# EAGLE design Control (EAGLE 9.6.2)
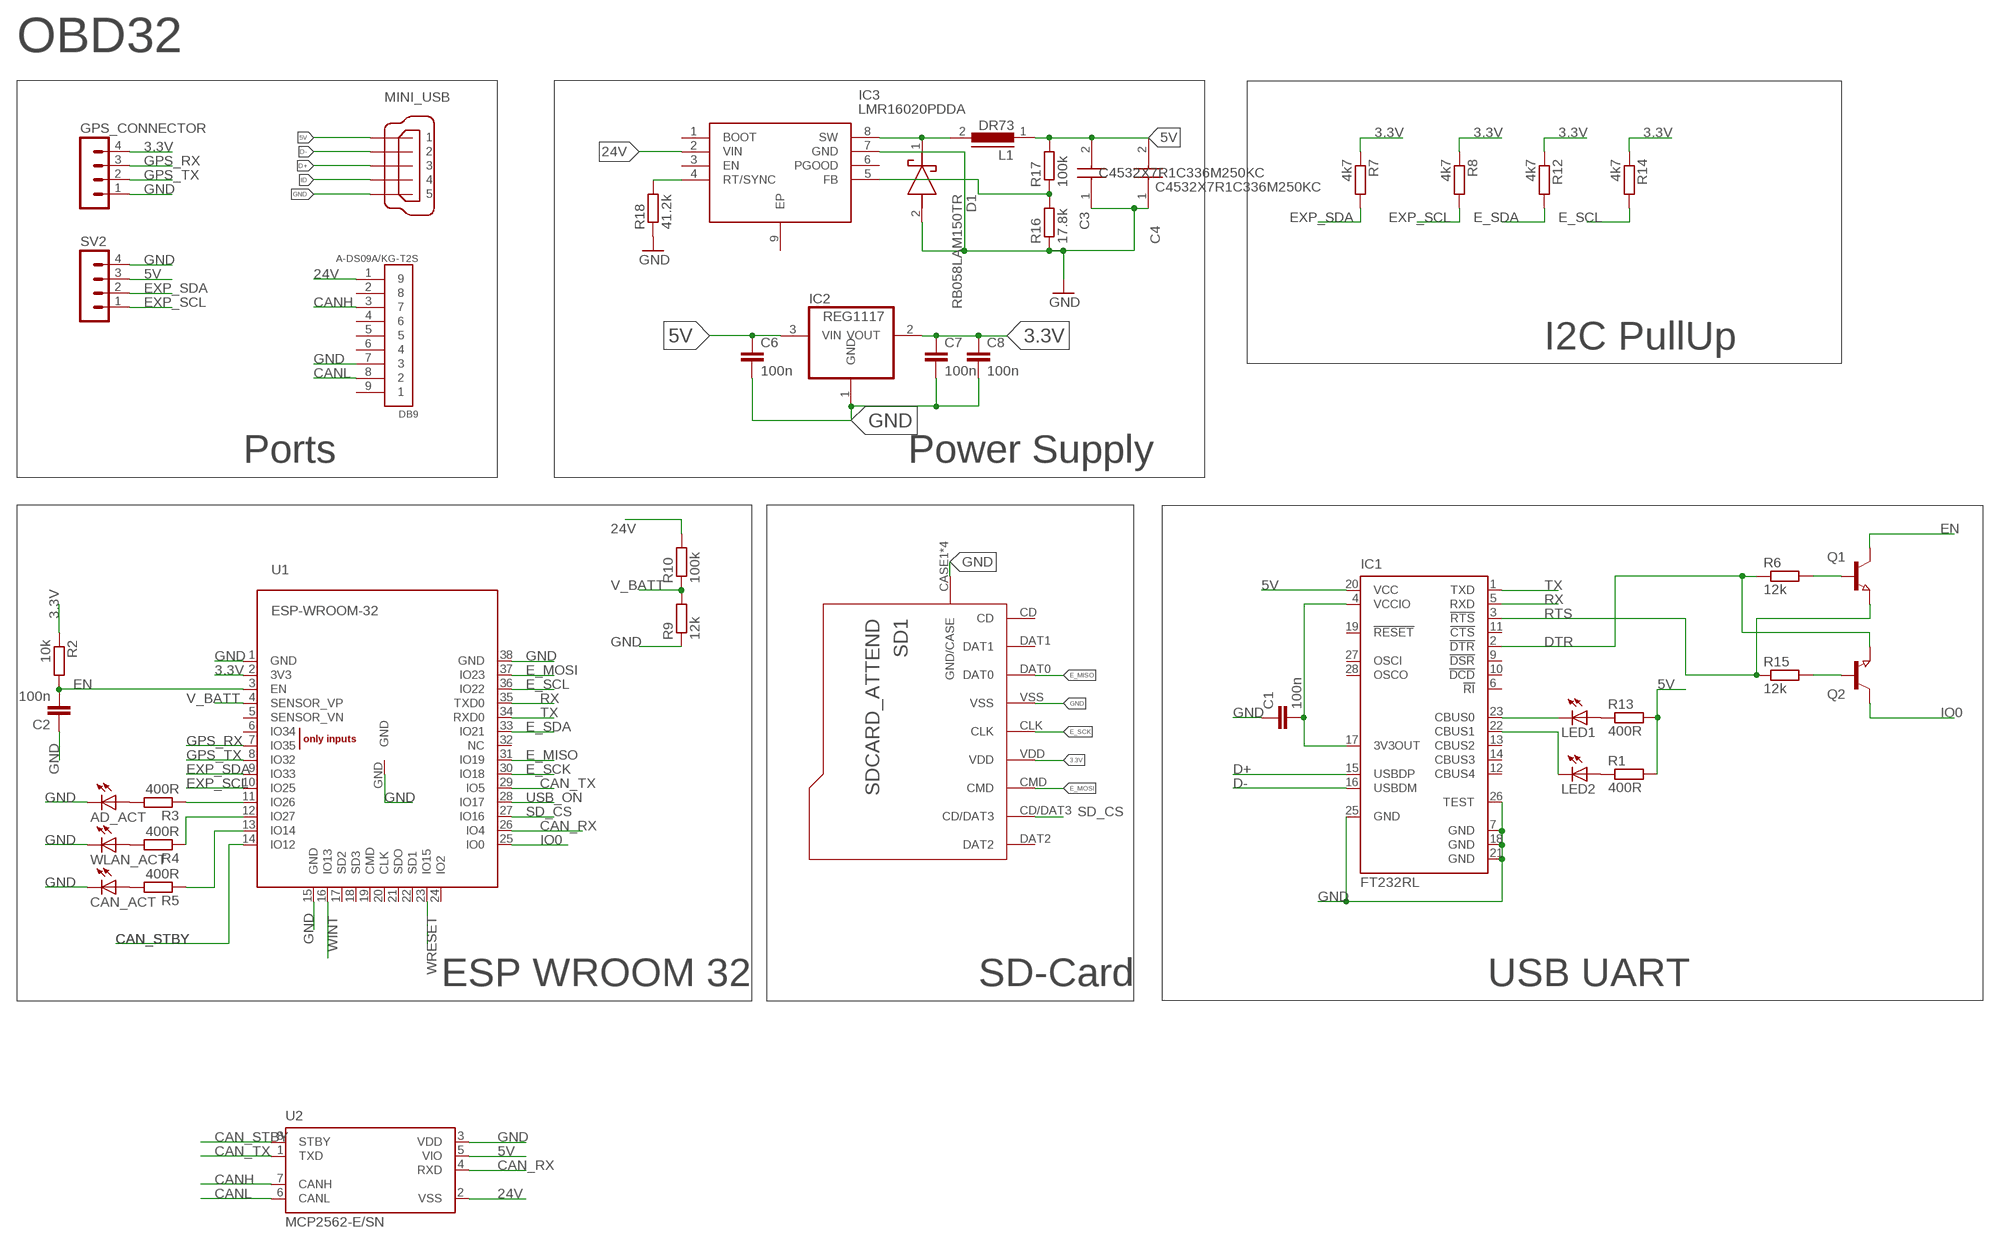
[diagram p0: schematic, sheet 1]

## Parts
AD_ACT  LEDCHIP-LED0805  [CHIP-LED0805]
C1  100n  C-EUC0805  [C0805]
C2  100n  C-EUC0805  [C0805]
C3  C4532X7R1C336M250KC  [CAPC4532X360N]
C4  C4532X7R1C336M250KC  [CAPC4532X360N]
C6  100n  C-EUC0805  [C0805]
C7  100n  C-EUC0805  [C0805]
C8  100n  C-EUC0805  [C0805]
CAN_ACT  LEDCHIP-LED0805  [CHIP-LED0805]
D1  RB058LAM150TR  [SODFL4725X105N]
DB9  A-DS09A/KG-T2S  [A-DS09A/KG-T2S]
GPS_CONNECTOR  MA04-1  [MA04-1]
IC1  FT232RL  [SSOP28]
IC2  REG1117  [SOT223]
IC3  LMR16020PDDA  [SOIC127P600X170-9N]
L1  DR73  [DR73]
LED1  LEDCHIPLED_0805  [CHIPLED_0805]
LED2  LEDCHIPLED_0805  [CHIPLED_0805]
MINI_USB  MINI-USB-32005-301  [32005-301]
Q1  NPN-TRANSISTOR_SOT23  [SOT23]
Q2  NPN-TRANSISTOR_SOT23  [SOT23]
R1  400R  R-EU_R0805  [R0805]
R2  10k  R-EU_R0805  [R0805]
R3  400R  R-EU_R0805  [R0805]
R4  400R  R-EU_R0805  [R0805]
R5  400R  R-EU_R0805  [R0805]
R6  12k  R-EU_R0805  [R0805]
R7  4k7  R-EU_R0805  [R0805]
R8  4k7  R-EU_R0805  [R0805]
R9  12k  R-EU_R0805  [R0805]
R10  100k  R-EU_R0805  [R0805]
R12  4k7  R-EU_R0805  [R0805]
R13  400R  R-EU_R0805  [R0805]
R14  4k7  R-EU_R0805  [R0805]
R15  12k  R-EU_R0805  [R0805]
R16  17.8k  R-EU_R0805  [R0805]
R17  100k  R-EU_R0805  [R0805]
R18  41.2k  R-EU_R0805  [R0805]
SD1  SDCARD_ATTEND  [SD_ATTEND]
SV2  MA04-1  [MA04-1]
U1  ESP-WROOM-32  [ESP-WROOM-32]
U2  MCP2562-E/SN  [SOIC127P600X175-8N]
WLAN_ACT  LEDCHIP-LED0805  [CHIP-LED0805]

## Nets
3.3V: C7.1 C8.1 GPS_CONNECTOR.4 IC2.2(VOUT) R2.1 R7.1 R8.1 R12.1 R14.1 SD1.VDD U1.2(3V3)
5V: C3.2 C4.2 C6.1 IC1.20(VCC) IC2.3(VIN) L1.1 MINI_USB.1 R1.2 R13.2 R17.2 SV2.3 U2.5(VIO)
24V: DB9.1 IC3.2(VIN) R10.2 U2.2(VSS)
CAN_RX: U1.26(IO4) U2.4(RXD)
CAN_STBY: U1.14(IO12) U2.8(STBY)
CAN_TX: U1.29(IO5) U2.1(TXD)
CANH [CANH]: DB9.3 U2.7(CANH)
CANL: DB9.8 U2.6(CANL)
D+: IC1.15(USBDP) MINI_USB.3
D-: IC1.16(USBDM) MINI_USB.2
DTR: IC1.2(!DTR) Q2.2(E) R6.1
E_MISO: SD1.DAT0 U1.31(IO19)
E_MOSI: SD1.CMD U1.37(IO23)
E_SCK: SD1.CLK U1.30(IO18)
E_SCL: R14.2 U1.36(IO22)
E_SDA: R12.2 U1.33(IO21)
EN: C2.2 Q1.3(C) R2.2 U1.3(EN)
EXP_SCL: R8.2 SV2.1 U1.10(IO25)
EXP_SDA: R7.2 SV2.2 U1.9(IO33)
GND: AD_ACT.C C1.1 C2.1 C3.1 C4.1 C6.2 C7.2 C8.2 CAN_ACT.C D1.2(A) DB9.7 GPS_CONNECTOR.1 IC1.7(GND) IC1.18(GND) IC1.21(GND) IC1.25(GND) IC1.26(TEST) IC2.1(GND) IC3.7(GND) MINI_USB.5 R9.1 R16.1 R18.1 SD1.CASE1(GND/CASE) SD1.CASE2(GND/CASE) SD1.CASE3(GND/CASE) SD1.CASE4(GND/CASE) SD1.VSS SV2.4 U1.1(GND) U1.15(GND) U1.38(GND) U1.GND U2.3(VDD) WLAN_ACT.C
GPS_RX: GPS_CONNECTOR.3 U1.7(IO35)
GPS_TX: GPS_CONNECTOR.2 U1.8(IO32)
ID: MINI_USB.4
IO0: Q2.3(C) U1.25(IO0)
N$1: IC1.23(CBUS0) LED1.C
N$3: IC3.5(FB) R16.2 R17.1
N$4: Q1.1(B) R6.2
N$5: C1.2 IC1.4(VCCIO) IC1.17(3V3OUT)
N$6: Q2.1(B) R15.2
N$7: AD_ACT.A R3.2
N$8: R3.1 U1.11(IO26)
N$9: IC1.22(CBUS1) LED2.C
N$10: LED1.A R13.1
N$11: D1.1(K) IC3.8(SW) L1.2
N$12: LED2.A R1.1
N$16: R4.2 WLAN_ACT.A
N$17: R4.1 U1.12(IO27)
N$18: CAN_ACT.A R5.2
N$19: R5.1 U1.13(IO14)
N$20: IC3.4(RT/SYNC) R18.2
RTS: IC1.3(!RTS) Q1.2(E) R15.1
RX: IC1.5(RXD) U1.35(TXD0)
SD_CS: SD1.CD/DAT3 U1.27(IO16)
TX: IC1.1(TXD) U1.34(RXD0)
USB_ON: U1.28(IO17)
V_BATT: R9.2 R10.1 U1.4(SENSOR_VP)
WINT: U1.16(IO13)
WRESET: U1.23(IO15)
Unconnected: DB9.2 DB9.4 DB9.5 DB9.6 DB9.9 IC1.6(!RI) IC1.9(!DSR) IC1.10(!DCD) IC1.11(!CTS) IC1.12(CBUS4) IC1.13(CBUS2) IC1.14(CBUS3) IC1.19(!RESET) IC1.27(OSCI) IC1.28(OSCO) IC3.1(BOOT) IC3.3(EN) IC3.6(PGOOD) IC3.9(EP) SD1.CD SD1.DAT1 SD1.DAT2 U1.5(SENSOR_VN) U1.6(IO34) U1.17(SD2) U1.18(SD3) U1.19(CMD) U1.20(CLK) U1.21(SDO) U1.22(SD1) U1.24(IO2) U1.32(NC)

## Notes on the sheet
- OBD32
- I2C PullUp
- Ports | Power Supply
- ESP WROOM 32 | SD-Card | USB UART

## Library data of the parts
AD_ACT CAN_ACT LED1 LED2 WLAN_ACT = led:LED: LED OSRAM: - CHIPLED LG R971, LG N971, LY N971, LG Q971, LY Q971, LO R971, LY R971 LH N974, LH R974 LS Q976, LO Q976, LY Q976 LO Q996 - Hyper CHIPLED LW Q18S LB Q993, LB Q99A, LB R99A - SideLED LS A670, LO A670, LY A670, LG A670, LP A670 LB A673, LV A673, LT A673, LW A673 LH A674 LY A675 LS A676, LA A676, LO A676, LY A676, LW A676 LS A679, LY A679, LG A679 - Hyper Micro SIDELED® LS Y876, LA Y876, LO Y876, LY Y876 LT Y87S - SmartLED LW L88C, LW L88S LB L89C, LB L89S, LG L890 LS L89K, LO L89K, LY L89K LS L896, LA L896, LO L896, LY L896 - TOPLED LS T670, LO T670, LY T670, LG T670, LP T670 LSG T670, LSP T670, LSY T670, LOP T670, LYG T670 LG T671, LOG T671, LSG T671 LB T673, LV T673, LT T673, LW T673 LH T674 LS T676, LA T676, LO T676, LY T676, LB T676, LH T676, LSB T676, LW T676 LB T67C, LV T67C, LT T67C, LS T67K, LO T67K, LY T67K, LW E67C LS E67B, LA E67B, LO E67B, LY E67B, LB E67C, LV E67C, LT E67C LW T67C LS T679, LY T679, LG T679 LS T770, LO T770, LY T770, LG T770, LP T770 LB T773, LV T773, LT T773, LW T773 LH T774 LS E675, LA E675, LY E675, LS T675 LS T776, LA T776, LO T776, LY T776, LB T776 LHGB T686 LT T68C, LB T68C - Hyper Mini TOPLED® LB M676 - Mini TOPLED Santana® LG M470 LS M47K, LO M47K, LY M47K Source: http://www.osram.convergy.de LUXEON: - LUMILED® LXK2-PW12-R00, LXK2-PW12-S00, LXK2-PW14-U00, LXK2-PW14-V00 LXK2-PM12-R00, LXK2-PM12-S00, LXK2-PM14-U00 LXK2-PE12-Q00, LXK2-PE12-R00, LXK2-PE12-S00, LXK2-PE14-T00, LXK2-PE14-U00 LXK2-PB12-K00, LXK2-PB12-L00, LXK2-PB12-M00, LXK2-PB14-N00, LXK2-PB14-P00, LXK2-PB14-Q00 LXK2-PR12-L00, LXK2-PR12-M00, LXK2-PR14-Q00, LXK2-PR14-R00 LXK2-PD12-Q00, LXK2-PD12-R00, LXK2-PD12-S00 LXK2-PH12-R00, LXK2-PH12-S00 LXK2-PL12-P00, LXK2-PL12-Q00, LXK2-PL12-R00 Source: www.luxeon.com KINGBRIGHT: KA-3528ASYC Source: www.kingbright.com
C1 C2 C6-C8 = rcl:C-EU: CAPACITOR, European symbol; SPICEPREFIX: C
C3 C4 = SamacSys_Parts:C4532X7R1C336M250KC: TDK 1812 C 33uF Ceramic Multilayer Capacitor, 16 V, +125C, X7R Dielectric, +/-20% SMD Source: Datasheet; DESCRIPTION: TDK 1812 C 33uF Ceramic Multilayer Capacitor, 16 V, +125C, X7R Dielectric, +/-20% SMD; HEIGHT: 3.6mm; MANUFACTURER_NAME: TDK; MANUFACTURER_PART_NUMBER: C4532X7R1C336M250KC; MOUSER_PART_NUMBER: 810-C4532X7R1C336M; MOUSER_PRICE-STOCK: https://www.mouser.co.uk/ProductDetail/TDK/C4532X7R1C336M250KC?qs=NRhsANhppD%252BjYbWDSZ5NuQ%3D%3D
D1 = SamacSys_Parts:RB058LAM150TR: Schottky Diodes & Rectifiers 150V Vr 3A Io Schottky Br Diode Source: Datasheet <https://componentsearchengine.com/Datasheets/1/RB058LAM150TR.pdf>; DESCRIPTION: Schottky Diodes & Rectifiers 150V Vr 3A Io Schottky Br Diode; HEIGHT: 1.05mm; MANUFACTURER_NAME: ROHM Semiconductor; MANUFACTURER_PART_NUMBER: RB058LAM150TR; MOUSER_PART_NUMBER: 755-RB058LAM150TR; MOUSER_PRICE-STOCK: https://www.mouser.co.uk/ProductDetail/ROHM-Semiconductor/RB058LAM150TR?qs=5aG0NVq1C4xBG06U%2Ff1mJQ%3D%3D
DB9 = D-Sub Connectors:A-DS09A/KG-T2S: CONN D-SUB PLUG 9POS R/A SOLDER Manufacturer's datasheet <http://www.assmann-wsw.com/fileadmin/datasheets/ASS_4888_CO.pdf>; CREATEDBY: PCBLayout.com; DIGI_KEY_PART_NUMBER: AE10968-ND; MANUFACTURER: Assmann WSW Components; MPN: A-DS 09 A/KG-T2S
GPS_CONNECTOR SV2 = con-lstb:MA04-1: PIN HEADER; OC_FARNELL: unknown; OC_NEWARK: unknown
IC1 = ftdichip:FT232R: Source: http://www.ftdichip.com/Documents/DataSheets/DS_FT232R_v104.pdf; MPN: FT232RL; OC_FARNELL: 1146032; OC_NEWARK: 91K9918
IC2 = burr-brown:REG1117: 800mA and 1A Low Dropout (LDO) Positive Regulator 1.8V, 2.5V, 2.85V, 3.3V, 5V, and Adj; MPN: REG1117; OC_FARNELL: 1097566; OC_NEWARK: 14P6981
IC3 = SamacSys_Parts:LMR16020PDDA: TEXAS INSTRUMENTS - LMR16020PDDA - DC/DC CONV, BUCK, 2.5MHZ, HSOIC-8 Source: Datasheet <http://www.ti.com/general/docs/lit/getliterature.tsp?genericPartNumber=LMR16020&fileType=pdf>; DESCRIPTION: TEXAS INSTRUMENTS - LMR16020PDDA - DC/DC CONV, BUCK, 2.5MHZ, HSOIC-8; HEIGHT: 1.7mm; MANUFACTURER_NAME: Texas Instruments; MANUFACTURER_PART_NUMBER: LMR16020PDDA; MOUSER_PART_NUMBER: 595-LMR16020PDDA; MOUSER_PRICE-STOCK: https://www.mouser.co.uk/ProductDetail/Texas-Instruments/LMR16020PDDA?qs=n%252BTO0c4TDSZBajvStWOY0A%3D%3D
L1 = inductors:DR73: High Power Density, High Efficiency, Shielded Inductors Source: coiltronics_dr_series.pdf; SPICEPREFIX: L
MINI_USB = con-cypressindustries:MINI-USB-: MINI USB-B Conector Source: www.cypressindustries.com; OC_FARNELL: unknown; OC_NEWARK: unknown
Q1 Q2 = semicon-smd-ipc:NPN-TRANSISTOR_: NPN TRANSISTOR
R1-R10 R12-R18 = rcl:R-EU_: RESISTOR, European symbol; SPICEPREFIX: R
SD1 = custom:SDCARD_ATTEND
U1 = esp32:ESP-WROOM-32
U2 = MCP2562-E_SN:MCP2562-E/SN: MCP2562 Series 5 V Surface Mount High-Speed CAN Transceiver - SOIC-8 Check prices <https://pricing.snapeda.com/parts/MCP2562-E/SN/Microchip/view-part?ref=eda>; AVAILABILITY: Good; DESCRIPTION: 1/1 Transceiver Half CANbus 8-SOIC; MF: Microchip; MP: MCP2562-E/SN; PACKAGE: SO-8 Microchip; PRICE: None; PURCHASE-URL: https://pricing.snapeda.com/search/part/MCP2562-E/SN/?ref=eda

## Board
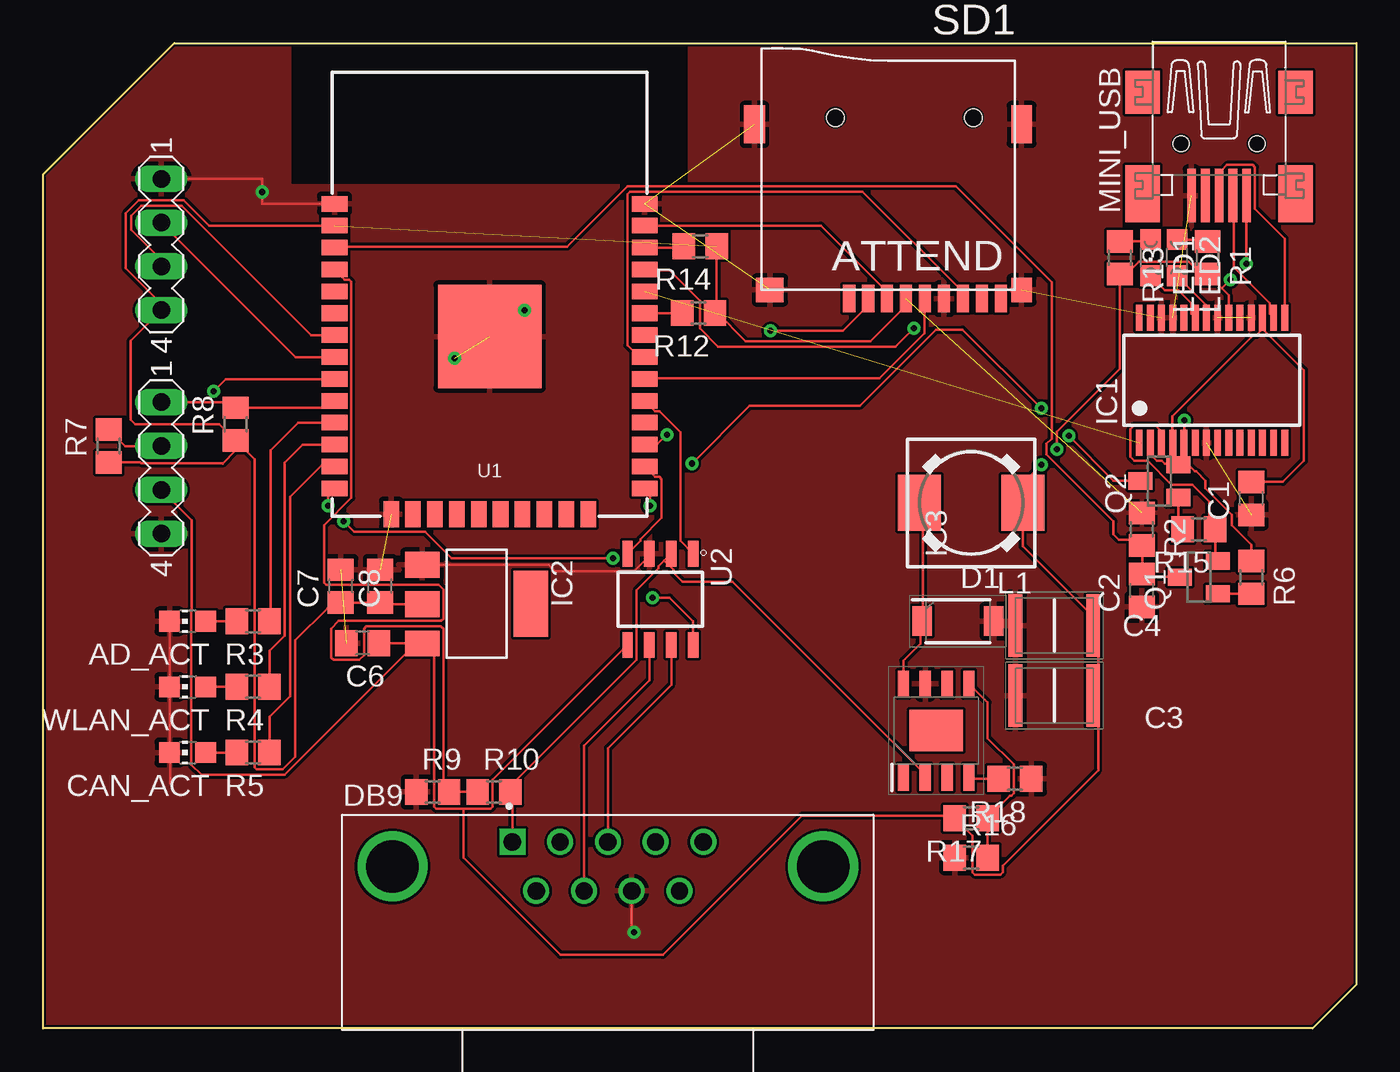
[diagram p1: board, top side]
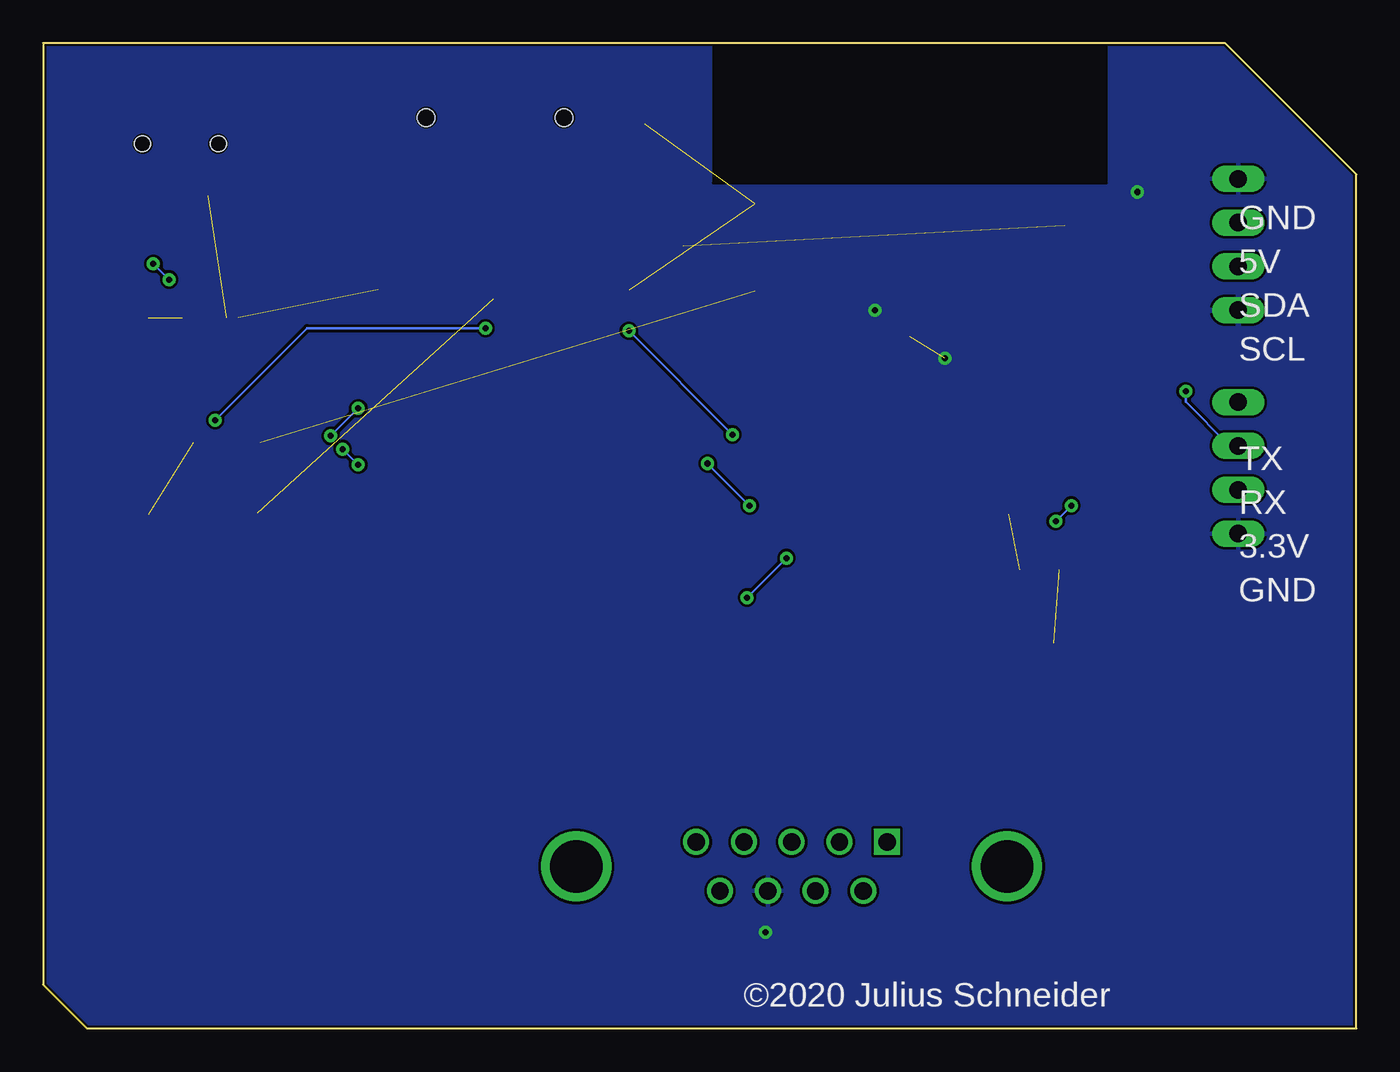
[diagram p2: board, bottom side, seen from below]

Size 76.2 x 57.15 mm. Coordinates in mm from the lower left corner, seen from the top.
Outline: 7.62,57.15 76.2,57.15 76.2,2.54 73.66,0 0,0 0,49.53 7.62,57.15
Copper layers (1*16): Top 0.035mm / dielectric 1.5mm / Bottom 0.035mm
Design rules "default *": minimum track width 6mil, minimum drill 0.35mm, track to track 6mil, track to pad 6mil, pad to pad 6mil, via to via 6mil, smd to smd 6mil, copper to edge 5mil, drill to drill 6mil, minimum pad ring 10mil, minimum via ring 8mil, stop-mask expansion 4mil, vias tented up to drill 0mil, thermal gap 10mil

### Footprints (pad centres in the part's own frame; a part is rotated, then mirrored left to right if it is on the bottom)
CHIP-LED0805 = smd 1.2 x 1.2: A 0,-1.05; C 0,1.05
C0805 = smd 1.3 x 1.5: 1 -0.95,0; 2 0.95,0
CAPC4532X360N = smd 0.81 x 3.61: 1 -2.25,0; 2 2.25,0
SODFL4725X105N = smd 1.12 x 1.72: 1 -2.075,0; 2 2.075,0
A-DS09A/KG-T2S = drill 1 square: 1 -5.54,1.42 | drill 1: 2 -2.77,1.42; 3 0,1.42; 4 2.77,1.42; 5 5.54,1.42; 6 4.155,-1.42; 7 1.385,-1.42; 8 -1.385,-1.42; 9 -4.155,-1.42 | drill 3.05: P$1 -12.495,0; P$2 12.495,0
MA04-1 = drill 1.016 long: 1 -3.81,0; 2 -1.27,0; 3 1.27,0; 4 3.81,0
SSOP28 = smd 0.4 x 1.5: 1 -4.225,-3.625; 2 -3.575,-3.625; 3 -2.925,-3.625; 4 -2.275,-3.625; 5 -1.625,-3.625; 6 -0.975,-3.625; 7 -0.325,-3.625; 8 0.325,-3.625; 9 0.975,-3.625; 10 1.625,-3.625; 11 2.275,-3.625; 12 2.925,-3.625; 13 3.575,-3.625; 14 4.225,-3.625; 15 4.225,3.625; 16 3.575,3.625; 17 2.925,3.625; 18 2.275,3.625; 19 1.625,3.625; 20 0.975,3.625; 21 0.325,3.625; 22 -0.325,3.625; 23 -0.975,3.625; 24 -1.625,3.625; 25 -2.275,3.625; 26 -2.925,3.625; 27 -3.575,3.625; 28 -4.225,3.625
SOT223 = smd 1.499 x 2.007: 1 -2.261,-3.15; 2 0.025,-3.15; 3 2.311,-3.15 | smd 3.81 x 2.007: 4 0,3.15
SOIC127P600X170-9N = smd 1.525 x 0.65: 1 -2.712,1.905; 2 -2.712,0.635; 3 -2.712,-0.635; 4 -2.712,-1.905; 5 2.712,-1.905; 6 2.712,-0.635; 7 2.712,0.635; 8 2.712,1.905 | smd 2.4 x 3.1: 9 0,0
DR73 = smd 2.5 x 3.25: 1 -3,0; 2 3,0
CHIPLED_0805 = smd 1.2 x 1.2: A 0,-1.05; C 0,1.05
32005-301 = smd 3.1 x 0.5: 1 3,1.6; 2 3,0.8; 3 3,0; 4 3,-0.8; 5 3,-1.6 | smd 2.5 x 2: M1 -3,-4.45; M2 -3,4.45 | smd 3.3 x 2: M3 2.9,4.45; M4 2.9,-4.45 | hole 0.9: 0,2.2; 0,-2.2
SOT23 = smd 1 x 1.4: 1 -0.95,-1.1; 2 0.95,-1.1; 3 0,1.1
R0805 = smd 1.3 x 1.5: 1 -0.95,0; 2 0.95,0
SD_ATTEND = smd 1.2 x 2.2: CASE1 -7.75,0.4; CASE2 7.75,0.4 | smd 1.6 x 1.4: CASE3 6.85,10 | smd 1.2 x 1.4: CASE4 -7.75,10 | smd 0.7 x 1.6: CD -6.55,10.5; CD/DAT3 1.15,10.5; CLK -2.15,10.5; CMD 0.05,10.5; DAT0 -4.35,10.5; DAT1 -5.45,10.5; DAT2 2.25,10.5; VDD -1.05,10.5; VSS -3.25,10.5 | hole 1: 3.05,0; -4.95,0
ESP-WROOM-32 = smd 0.9 x 1.5: 1 7.7,9; 2 6.43,9; 3 5.16,9; 4 3.89,9; 5 2.62,9; 6 1.35,9; 7 0.08,9; 8 -1.19,9; 9 -2.46,9; 10 -3.73,9; 11 -5,9; 12 -6.27,9; 13 -7.54,9; 14 -8.81,9; 25 -8.81,-9; 26 -7.54,-9; 27 -6.27,-9; 28 -5,-9; 29 -3.73,-9; 30 -2.46,-9; 31 -1.19,-9; 32 0.08,-9; 33 1.35,-9; 34 2.62,-9; 35 3.89,-9; 36 5.16,-9; 37 6.43,-9; 38 7.7,-9 | smd 1.5 x 0.9: 15 -10.3,5.715; 16 -10.3,4.445; 17 -10.3,3.175; 18 -10.3,1.905; 19 -10.3,0.635; 20 -10.3,-0.635; 21 -10.3,-1.905; 22 -10.3,-3.175; 23 -10.3,-4.445; 24 -10.3,-5.715 | smd 6 x 6: GND 0,0
SOIC127P600X175-8N = smd 1.5 x 0.6: 1 -2.65,1.905; 2 -2.65,0.635; 3 -2.65,-0.635; 4 -2.65,-1.905; 5 2.65,-1.905; 6 2.65,-0.635; 7 2.65,0.635; 8 2.65,1.905

### Placement (x,y rotation side)
AD_ACT  8.38,23.62 90 top
C1  70.1,30.73 90 top
C2  63.75,25.4 90 top
C3  58.67,19.3 0 top
C4  58.67,23.37 0 top
C6  18.54,22.35 180 top
C7  17.27,25.65 90 top
C8  19.56,25.65 90 top
CAN_ACT  8.38,16 90 top
D1  53.09,23.62 0 top
DB9  32.77,9.4 0 top
GPS_CONNECTOR  6.86,45.47 270 top
IC1  67.82,37.59 0 top
IC2  25.15,24.64 270 top
IC3  51.82,17.27 90 top
L1  53.85,30.48 180 top
LED1  64.26,44.7 180 top
LED2  65.79,44.7 180 top
MINI_USB  68.23,51.31 270 top
Q1  67.06,26.16 90 top
Q2  64.77,31.75 90 top
R1  67.56,44.7 270 top
R2  63.75,28.96 270 top
R3  12.19,23.62 180 top
R4  12.19,19.81 180 top
R5  12.19,16 180 top
R6  70.1,26.16 270 top
R7  3.81,33.78 90 top
R8  11.18,35.05 90 top
R9  22.61,13.72 0 top
R10  26.16,13.72 0 top
R12  38.04,41.5 180 top
R13  62.48,44.7 270 top
R14  38.13,45.37 180 top
R15  67.06,28.96 180 top
R16  53.85,9.91 0 top
R17  53.85,12.19 180 top
R18  56.39,14.48 180 top
SD1  49.02,52.83 180 top
SV2  6.86,32.51 270 top
U1  25.91,40.13 90 top
U2  35.81,24.89 270 top
WLAN_ACT  8.38,19.81 90 top

### Tracks (layer width: path | path; a pad name or v marks a point on that pad's centre or on a via)
3.3V  (2 unrouted)
  Top 0.152: R7.1 5.64,32.83 5.69,32.79 10.39,32.79 10.41,32.77 11.18,33.53 R8.1 | R8.1 10.23,35.05 5.33,35.05 5.08,35.31 5.08,39.88 GPS_CONNECTOR.4 6.86,42.03 4.8,44.09 4.8,47.27 5.56,48.03 8.16,48.03 9.63,46.56 U1.2 | IC2.2 19.65,24.61 C8.1 C7.1 17.22,24.69 16.84,24.69 16.54,24.38 16.51,24.38 14.63,22.5 14.63,15.77 13.89,15.02 12.4,15.02 12.26,15.16 12.26,33.02 R8.1 | R14.1 39.08,41.59 R12.1 39.09,41.53 40.77,39.85 48.01,39.85 50.06,41.91 50.06,42.29 SD1.VDD
  pour Bottom: 76.2,2.54 76.2,57.15 -2.54,57.15 -10.16,49.53 -10.16,0 73.66,0
  pour Top (isolate 0.305): 76.2,57.15 0,0 76.2,0
5V  (via drill 0.35)
  Top 0.152: SV2.3 8.61,29.49 8.61,24.32 8.6,24.32 8.6,15.31 9.19,14.72 14.01,14.72 21.49,22.2 | 21.49,22.2 21.62,22.33 IC2.3 22.68,21.65 22.68,12.87 22.81,12.74 24.38,12.74 | C6.1 21.34,22.35 21.49,22.2 | 24.38,12.74 25.96,12.74 26.09,12.87 26.09,14.42 U2.5 | 68.38,42.93 R1.2 67.21,43.75 66.48,44.48 63.57,44.48 62.84,43.75 R13.2 62.48,38.25 58.83,34.59 v58.83,33.6 | 68.38,42.93 68.79,42.52 IC1.20 | 61.21,19.28 61.21,14.99 55.68,9.45 55.68,9.06 55.54,8.93 54.05,8.93 53.92,9.06 53.92,11.17 R17.2 52.88,12.19 52.73,12.34 44.04,12.34 35.97,4.27 30.02,4.27 24.38,9.91 24.38,12.74 | 61.21,19.28 61.21,23.08 C4.2 60.88,23.39 60.88,23.93 56.84,27.96 L1.1 56.92,30.48 56.92,31.7 v57.91,32.69 | v69.8,44.35 69.8,48.23 MINI_USB.1 | 68.38,42.93 v68.89,43.43 | 61.21,19.28 60.96,19.28 C3.2
  Bottom 0.152: v68.89,43.43 v69.8,44.35 | v57.91,32.69 v58.83,33.6
24V
  Top 0.152: DB9.1 27.23,13.6 R10.2 27.11,14.07 34.44,21.4 34.44,25.43 35.71,26.7 35.71,26.8 36.04,27.13 | 36.04,27.13 U2.2 | 36.04,27.13 36.58,26.59 36.58,26.44 37.11,25.91 40.01,25.91 51.13,14.78 51.13,14.63 IC3.2
CAN_RX
  Top 0.152: U2.4 34.65,28.28 34.65,28.39 35.89,29.62 35.89,31.87 35.75,32 35.5,32 U1.26
CAN_STBY  (via drill 0.35)
  Top 0.152: 17.58,31.32 U1.14 16.84,31.32 16.54,31.01 v16.54,30.33 | U2.8 37.72,23.62 36.35,24.99 v35.36,24.99 | v33.07,27.28 23.7,27.28 22.17,28.8 18.06,28.8 v17.45,29.41
  Bottom 0.152: v33.07,27.28 v35.36,24.99 | v16.54,30.33 v17.45,29.41
CAN_TX
  Top 0.152: U2.1 36.98,28.28 36.98,34.59 35.75,35.81 35.5,35.81 U1.29
CANH
  Top 0.152: U2.7 36.45,19.94 32.77,16.26 DB9.3
CANL
  Top 0.152: U2.6 35.18,20.19 31.38,16.39 DB9.8
D+
  Top 0.152: IC1.15 72.04,45.81 70.31,47.55 70.31,49.95 70.17,50.09 68.69,50.09 68.38,49.78 68.28,49.78 | 68.28,49.78 68.07,49.78 | 68.28,49.78 68.28,48.31 MINI_USB.3
D-
  Top 0.152: MINI_USB.2 69.09,48.25 69.09,44.15 71.17,42.06 71.17,41.44 IC1.16
DTR
  Top 0.152: IC1.2 64.31,33.91 64.31,33.22 64.62,32.92 64.92,32.92 65.08,32.77 65.84,32.77 Q2.2 65.91,32.69 66.45,32.69 66.83,32.31 66.9,32.31 67.44,31.77 67.44,31.32 68.96,29.79 68.96,29.18 70.1,28.04 R6.1
E_MISO
  Top 0.152: U1.31 34.9,39.01 34.52,39.01 33.91,39.62 33.91,48.39 34.06,48.54 47.55,48.54 53.34,42.75 53.34,42.37 SD1.DAT0
E_MOSI
  Top 0.152: U1.37 45.13,46.56 48.77,42.93 48.77,42.9 48.92,42.75 48.92,42.37 SD1.CMD
E_SCK
  Top 0.152: U1.30 34.98,37.72 48.54,37.72 51.13,40.31 51.13,42.29 SD1.CLK
E_SCL
  Top 0.152: R14.2 37.1,45.29 U1.36
E_SDA
  Top 0.152: U1.33 37.07,41.48 R12.2
EN
  Top 0.152: Q1.3 65.91,26.21 63.86,26.21 63.78,26.29 C2.2 63.78,26.36 63.78,27.96 R2.2 63.7,28.04 63.4,28.35 62.41,28.35 62.1,28.65 62.1,29.41 58.22,33.3 58.22,33.91 58.52,34.21 58.52,43.28 52.96,48.84 33.91,48.84 30.4,45.34 16.92,45.34 U1.3
EXP_SCL
  Top 0.152: SV2.1 10.86,36.32 R8.2 16.51,36 U1.10
EXP_SDA  (via drill 0.35)
  Top 0.152: SV2.2 4.76,33.78 R7.2 | v9.91,36.96 10.59,37.64 16.84,37.64 U1.9
  Bottom 0.152: v9.91,36.96 9.91,36.35 7.39,33.83 6.86,33.83 SV2.2
GND  (via drill 0.35)  (9 unrouted)
  Top 0.152: 7.37,14.22 7.37,15.97 CAN_ACT.C WLAN_ACT.C AD_ACT.C | 17.45,47.83 U1.1 12.7,47.83 v12.7,48.51 12.7,49.28 GPS_CONNECTOR.1 | DB9.7 34.15,5.59 v34.29,5.59 | IC2.1 29.34,26.9 29.72,26.52 34.29,26.52 35.13,27.36 35.13,27.51 U2.3
  other vias: 27.94,41.66 23.88,38.86
  pour Top: 76.2,2.54 76.2,57.15 -2.54,57.15 -10.16,49.53 -10.16,0 73.66,0
  pour Bottom: 76.2,57.4 0,57.4 0,0 76.2,0
GPS_RX
  Top 0.152: U1.7 15.54,40.21 8.03,47.73 5.69,47.73 5.11,47.15 5.11,46.33 6.86,44.57 GPS_CONNECTOR.3
GPS_TX
  Top 0.152: U1.8 14.65,38.94 GPS_CONNECTOR.2
IO0  (via drill 0.35)
  Top 0.152: v59.51,34.37 62.1,31.77 63.63,31.77 Q2.3 | v57.91,35.97 53.34,40.54 51.82,40.54 47.4,36.12 41,36.12 v37.64,32.77 | v35.2,30.33 35.2,31.09 34.98,31.32 U1.25
  Bottom 0.152: v57.91,35.97 v59.51,34.37 | v35.2,30.33 v37.64,32.77
N$1
  Top 0.152: IC1.23 66.62,41.44 66.62,42.06 65.86,42.83 65.09,42.83 LED1.C
N$3
  Top 0.152: IC3.5 54.8,18.91 54.8,16.84 56.32,15.32 56.32,13.63 56.18,13.5 56.1,13.5 R17.1 54.94,12.27 54.94,11.81 54.99,11.81 55.12,11.68 54.8,11.36 R16.2
N$4
  Top 0.152: Q1.1 R6.2
N$5
  Top 0.152: 70.79,40.69 70.79,41.15 IC1.17 70.79,40.69 | 70.79,40.69 70.79,40.54 73.15,38.18 73.15,32.92 71.93,31.7 70.1,31.7 C1.2 | 70.79,40.69 70.71,40.62 70.71,40.54 70.41,40.23 70.26,40.23 65.53,35.51 65.53,33.98 IC1.4
N$6
  Top 0.152: Q2.1 65.87,29.19 R15.2
N$7
  Top 0.152: AD_ACT.A R3.2
N$8
  Top 0.152: U1.11 14.81,35.13 13.21,33.53 13.21,24.38 13.18,24.38 13.18,23.62 R3.1
N$9
  Top 0.152: LED2.C 67.49,41.95 IC1.22
N$10
  Top 0.152: R13.1 64.16,45.65 LED1.A
N$11
  Top 0.152: IC3.8 49.91,21.34 50.9,22.33 50.9,23.55 50.98,23.62 D1.1 51.05,23.62 51.05,30.33 50.9,30.48 L1.2
N$12
  Top 0.152: LED2.A 67.46,45.75 R1.1
N$16
  Top 0.152: WLAN_ACT.A R4.2
N$17
  Top 0.152: R4.1 13.14,21.9 14.02,22.78 14.02,32.82 15.07,33.86 U1.12
N$18
  Top 0.152: CAN_ACT.A R5.2
N$19
  Top 0.152: R5.1 13.14,18.09 14.32,19.27 14.32,30.84 16.26,32.77 16.31,32.77 16.46,32.61 16.84,32.61 U1.13
N$20
  Top 0.152: R18.2 53.8,14.48 IC3.4
RTS
  Top 0.152: Q1.2 68.01,27.26 R15.1 67.97,28.96 67.67,29.26 67.67,30.56 66.67,31.55 65.46,31.55 64.08,32.92 63.32,32.92 63.09,33.15 63.09,34.75 63.32,34.98 64.54,34.98 64.85,34.67 64.85,33.98 IC1.3
RX  (via drill 0.35)
  Top 0.152: v50.52,40.62 49.45,39.55 39.17,39.55 38.1,40.62 38.1,42.22 36.35,43.97 34.98,43.97 U1.35 | v66.22,35.28 66.22,33.98 IC1.5
  Bottom 0.152: v50.52,40.62 60.88,40.62 v66.22,35.28
SD_CS  (via drill 0.35)
  Top 0.152: v36.2,34.44 35.66,33.91 34.98,33.91 U1.27 | v42.22,40.46 46.41,40.46 47.85,41.91 47.85,42.29 SD1.CD/DAT3
  Bottom 0.152: v42.22,40.46 v36.2,34.44
TX  (1 unrouted)
V_BATT
  Top 0.152: U1.4 17.5,43.43 17.75,43.43 17.89,43.3 17.89,30.78 16.29,29.18 16.29,25.86 16.43,25.73 22.96,25.73 23.23,25.46 23.23,23.77 23.09,23.64 17.15,23.64 16.71,23.2 16.71,21.51 16.85,21.37 18.34,21.37 18.61,21.65 18.61,23.2 18.75,23.33 23.07,23.33 23.23,23.17 23.23,14.04 R9.2 R10.1

### Text on the board
bNames: GND | 5V | SDA | SCL | TX | RX | 3.3V | GND | ©2020 Julius Schneider